# Altium schematic sheet Memory.SchDoc
size Letter; CompanyName: Penn Electric Racing; Organization: Penn Electric Racing; Address1: 220 S. 33rd St; Address2: Towne Bldg, B11; Address3: Philadelpia, PA 19104; Address4: USA; SheetNumber: 3; SheetTotal: 11
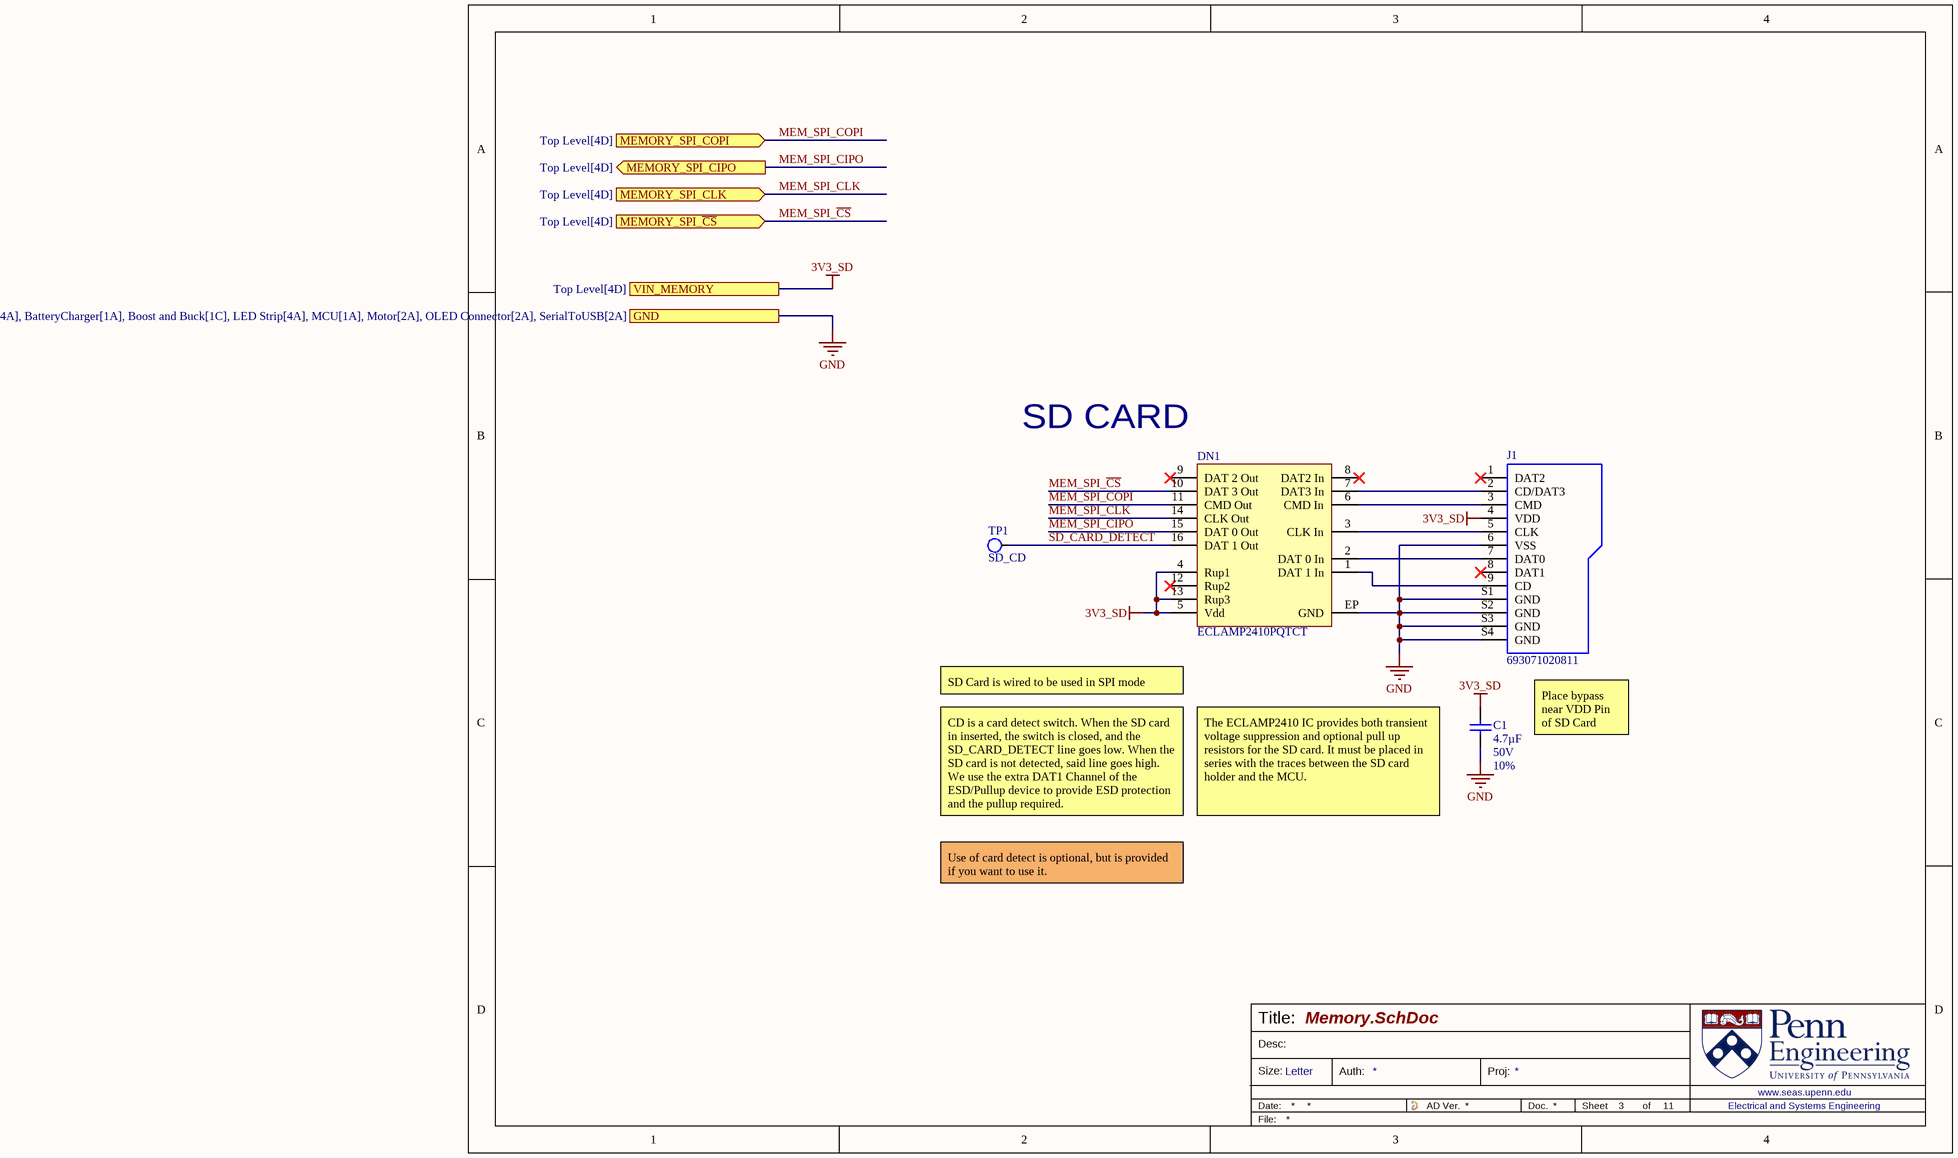
[diagram p0: Memory.SchDoc]

## Parts
C1  value 4.7µF  Voltage: 50V  Tolerance: 10%  [0805_CAP]  (hidden comment: CAP 0805 4.7UF 50V 10% X5R)
DN1  ECLAMP2410PQTCT  [ECLAMP2410PQTCT-Footprint-1]
J1  693071020811  [693071020811]
TP1  NetName: SD_CD  [Test PTH 15-30]  (hidden comment: Testpad)  (no BOM)

## Ports
GND (see Top Level[4D], AI_Audio_Module[4A], BatteryCharger[1A], Boost and Buck[1C], LED Strip[4A], MCU[1A], Motor[2A], OLED Connector[2A], SerialToUSB[2A]), MEMORY_SPI_CIPO (out, see Top Level[4D]), MEMORY_SPI_CLK (in, see Top Level[4D]), MEMORY_SPI_COPI (in, see Top Level[4D]), MEMORY_SPI_~{CS} (in, see Top Level[4D]), VIN_MEMORY (see Top Level[4D])

## Nets
3V3_SD: C1.2 DN1.4(Rup1) DN1.5(Vdd) DN1.13(Rup3) J1.4(VDD) ; port VIN_MEMORY
GND: C1.1 DN1.EP(GND) J1.6(VSS) J1.S1(GND) J1.S2(GND) J1.S3(GND) J1.S4(GND) ; port GND
MEM_SPI_~{CS}: DN1.10(DAT_3_Out) ; port MEMORY_SPI_~{CS}
MEM_SPI_CIPO: DN1.15(DAT_0_Out) ; port MEMORY_SPI_CIPO
MEM_SPI_CLK: DN1.14(CLK_Out) ; port MEMORY_SPI_CLK
MEM_SPI_COPI: DN1.11(CMD_Out) ; port MEMORY_SPI_COPI
SD_CARD_DETECT: DN1.16(DAT_1_Out) TP1.1
NetDN1_1: DN1.1(DAT_1_In) J1.9(CD)
NetDN1_2: DN1.2(DAT_0_In) J1.7(DAT0)
NetDN1_3: DN1.3(CLK_In) J1.5(CLK)
NetDN1_6: DN1.6(CMD_In) J1.3(CMD)
NetDN1_7: DN1.7(DAT3_In) J1.2(CD/DAT3)

Not connected (* = marked no-connect by the designer): DN1 8(DAT2_In)* 9(DAT_2_Out)* 12(Rup2)*; J1 1(DAT2)* 8(DAT1)*

## Notes on the sheet
- SD CARD
- SD Card is wired to be used in SPI mode
- Place bypass near VDD Pin of SD Card
- CD is a card detect switch. When the SD card in inserted, the switch is closed, and the SD_CARD_DETECT line goes low. When the SD card is not detected, said line goes high. We use the extra DAT1 Channel of the ESD/Pullup device to provide ESD protection and the pullup required.
- (near C1) The ECLAMP2410 IC provides both transient voltage suppression and optional pull up resistors for the SD card. It must be placed in series with the traces between the SD card holder and the MCU.
- Use of card detect is optional, but is provided if you want to use it.
- Title:
- Desc:
- Size:
- Letter
- Auth:
- Proj:
- Sheet
- of
- www.seas.upenn.edu
- Electrical and Systems Engineering

## Library data of the parts
C1 = CMP-001-00021-2: Capacitor Surface Mount 0805 Footprint 4.7UF 50V 10% Tolerance Ceramic X5R; P/N: CAP 0805 4.7UF 35V 10% X5R; Description in Visual: Cap SMT 0805 4.7UF 35V 10%  Cer X5R; PCB Package: 0805; RoHS: Yes; Type: Ceramic X5R; Mount: SMT; Capacitor Type: Ceramic; Pins: 2; Case/Package: 0805
DN1 = CMP-00096-2: Trans Voltage Suppressor Diode, 5V V(RWM), Bidirectional, 7 Element, Silicon with EMI Filter; Filter Type: DATA LINE FILTER; Reach SVHC Compliant: Yes; RoHS Compliant: Yes
J1 = CMP-00419-6: WR-CRD Micro SD Card Connector Push & Push; Rated Current: 0.5A; Working Voltage: 30VAC; Contact Resistance: 100mOhm; Gender: Socket; Withstanding Voltage: 500VAC; Pin Number: 8; Mounting Technology: SMT; Source: WR-CRD.SchLib; Type: Push & Push; ComponentLink2Description: Datasheet; Packaging: Tape and Reel; ComponentLink1Description: Manufacturer; Design Item ID: 693071020811; Memory Card Type: Micro SD; Publisher: Wurth Elektronik; Operating Temperature: -40 to +85degC; ComponentLink2URL: https://katalog.we-online.com/em/datasheet/693071020811.pdf; Number of Contacts: 8; Part Number: 693071020811; Published Date: November 2019; ComponentLink1URL: http://www.we-online.de
TP1 = CMP-00049-8: Test Pad/Point (Testpoint, Testpad), for probing